# EAGLE design untitled (EAGLE 9.6.2)
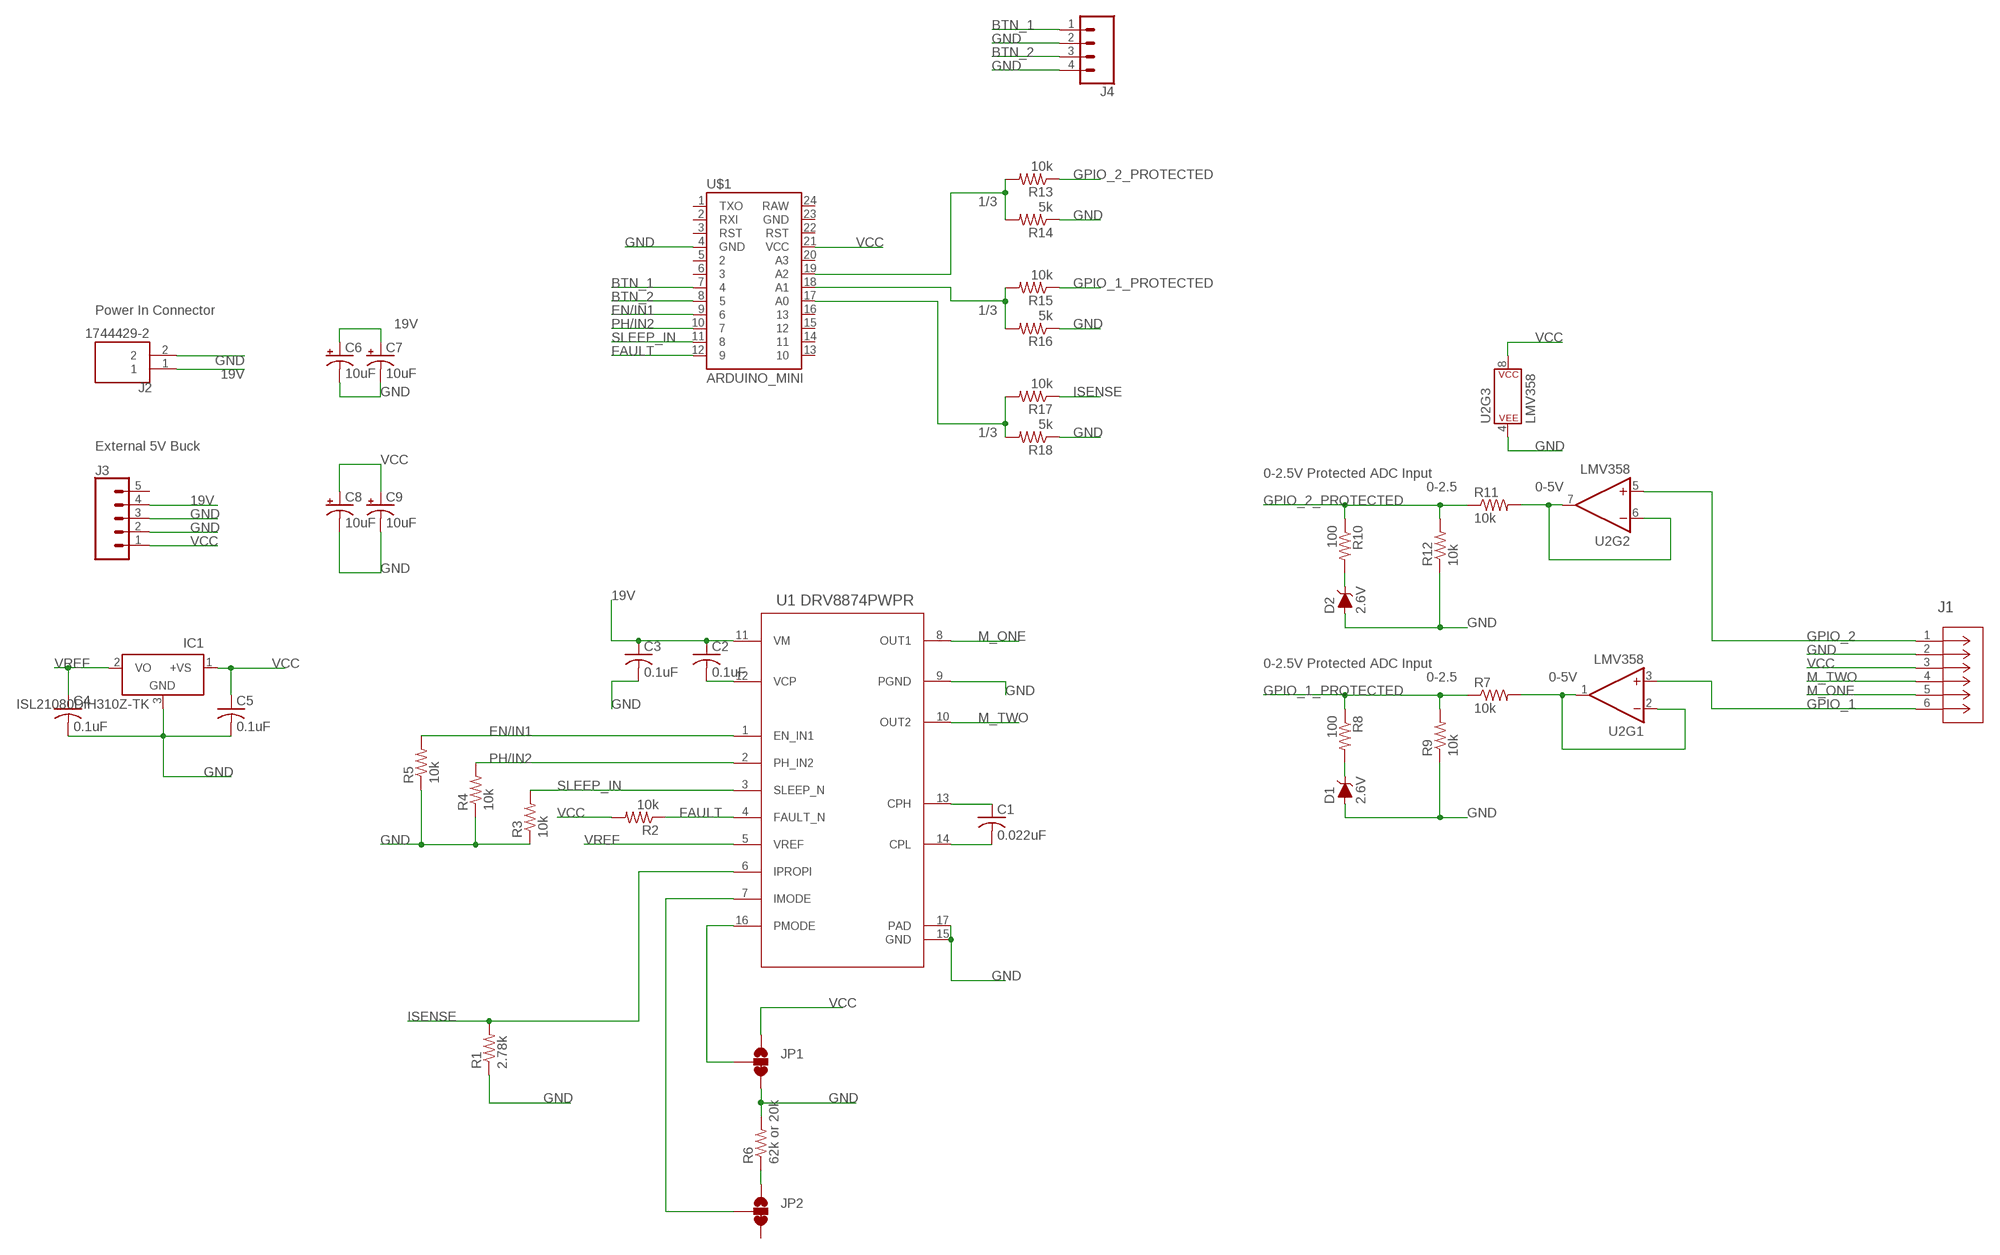
[diagram p0: schematic, sheet 1]

## Parts
C1  0.022uF  C-USC0805K  [C0805K]
C2  0.1uF  C-USC0805K  [C0805K]
C3  0.1uF  C-USC0805K  [C0805K]
C4  0.1uF  C-USC0805K  [C0805K]
C5  0.1uF  C-USC0805K  [C0805K]
C6  10uF  CPOL-USE2.5-6  [E2,5-6]
C7  10uF  CPOL-USE2.5-6  [E2,5-6]
C8  10uF  CPOL-USE2.5-6  [E2,5-6]
C9  10uF  CPOL-USE2.5-6  [E2,5-6]
D1  2.6V  DIODE-ZENER-BZT52C3V6S  [SOD-323]
D2  2.6V  DIODE-ZENER-BZT52C3V6S  [SOD-323]
IC1  ISL21080DIH310Z-TK  LM50  [SOT23]
J1  39301060  [CON_39301060]
J2  1744429-2  [TE_1744429-2]
J3  CONN_05  [1X05]
J4  CONN_041X04_NO_SILK  [1X04_NO_SILK]
JP1  JUMPER-SMT_3_1-NC_TRACE_SILK  [SMT-JUMPER_3_1-NC_TRACE_SILK]
JP2  JUMPER-SMT_3_1-NC_TRACE_SILK  [SMT-JUMPER_3_1-NC_TRACE_SILK]
R1  2.78k  R-US_R0805  [R0805]
R2  10k  R-US_R0805  [R0805]
R3  10k  R-US_R0805  [R0805]
R4  10k  R-US_R0805  [R0805]
R5  10k  R-US_R0805  [R0805]
R6  62k or 20k  R-US_R0805  [R0805]
R7  10k  R-US_R0805  [R0805]
R8  100  R-US_R0805  [R0805]
R9  10k  R-US_R0805  [R0805]
R10  100  R-US_R0805  [R0805]
R11  10k  R-US_R0805  [R0805]
R12  10k  R-US_R0805  [R0805]
R13  10k  R-US_R0805  [R0805]
R14  5k  R-US_R0805  [R0805]
R15  10k  R-US_R0805  [R0805]
R16  5k  R-US_R0805  [R0805]
R17  10k  R-US_R0805  [R0805]
R18  5k  R-US_R0805  [R0805]
U1  DRV8874PWPR  [PWP0016J_N]
U2  LMV358  LMV358SOIC  [SO08]
U$1  ARDUINO_MINI  [ARDUINO_MINI]

## Nets
19V: C2.1 C3.1 C6.+ C7.+ J2.1 J3.4 U1.11(VM)
BTN_1: J4.1 U$1.7
BTN_2: J4.3 U$1.8
EN/IN1: R5.2 U1.1(EN_IN1) U$1.9
FAULT: R2.1 U1.4(FAULT_N) U$1.12
GND: C3.2 C4.2 C5.2 C6.- C7.- C8.- C9.- D1.A D2.A IC1.3(GND) J1.2 J2.2 J3.2 J3.3 J4.2 J4.4 JP1.3 R1.1 R3.1 R4.1 R5.1 R6.2 R9.1 R12.1 R14.1 R16.1 R18.1 U1.9(PGND) U1.15(GND) U1.17(PAD) U2.4(P$V-) U$1.4(GND)
GPIO_1: J1.6 U2.3(+IN)
GPIO_1_PROTECTED: R7.1 R8.1 R9.2 R15.1
GPIO_2: J1.1 U2.5(+IN)
GPIO_2_PROTECTED: R10.1 R11.1 R12.2 R13.1
ISENSE: R1.2 R17.1 U1.6(IPROPI)
M_ONE: J1.5 U1.8(OUT1)
M_TWO: J1.4 U1.10(OUT2)
N$1: C1.2 U1.14(CPL)
N$2: C1.1 U1.13(CPH)
N$3: R17.2 R18.2 U$1.17(A0)
N$4: C2.2 U1.12(VCP)
N$5: JP1.2 U1.16(PMODE)
N$6: R7.2 U2.1(OUT) U2.2(-IN)
N$7: D1.C R8.2
N$8: R11.2 U2.6(-IN) U2.7(OUT)
N$9: D2.C R10.2
N$10: JP2.2 U1.7(IMODE)
N$12: JP2.1 R6.1
N$13: R13.2 R14.2 U$1.19(A2)
N$15: R15.2 R16.2 U$1.18(A1)
PH/IN2: R4.2 U1.2(PH_IN2) U$1.10
SLEEP_IN: R3.2 U1.3(SLEEP_N) U$1.11
VCC: C5.1 C8.+ C9.+ IC1.1(+VS) J1.3 J3.1 JP1.1 R2.2 U2.8(P$V+) U$1.21(VCC)
VREF: C4.1 IC1.2(VO) U1.5(VREF)
Unconnected: J3.5 JP2.3 U$1.1(TXO) U$1.2(RXI) U$1.3(RST) U$1.5 U$1.6 U$1.13 U$1.14 U$1.15 U$1.16 U$1.20(A3) U$1.22(RST) U$1.23(GND) U$1.24(RAW)

## Notes on the sheet
- 1/3
- Power In Connector | 1/3
- 1/3
- External 5V Buck
- 0-2.5V Protected ADC Input
- 0-2.5 | 0-5V
- 0-2.5V Protected ADC Input
- 0-2.5 | 0-5V

## Library data of the parts
C1-C5 = adafruit:C-US: CAPACITOR, American symbol
C6-C9 = adafruit:CPOL-US: POLARIZED CAPACITOR, American symbol
D1 D2 = SparkFun-DiscreteSemi:DIODE-ZENER: Zener Diode A Zener diode allows current to flow from its anode to its cathode like a normal semiconductor diode, but it also permits current to flow in the reverse direction when its "Zener voltage" is reached. - WIkipedia; PROD_ID: DIO-08199; VALUE: 3.6V
IC1 = linear:LM50: SOT-23 Single-Supply Centigrade Temperature Sensor Vout = (10mV/°C x Temp °C) +5mmmV Source: http://cache.national.com/ds/LM/LM50.pdf
J1 = 39301060:39301060; COPYRIGHT: Copyright (C) 2022 Ultra Librarian. All rights reserved.; MANUFACTURER_PART_NUMBER: 39301060; MFR_NAME: Molex Connector Corporation
J2 = 1744429-2:1744429-2: 3.96 EP HDR ASSY 6P W/PEGS, GW,NO PIN 3; MANUFACTURER: TE; PARTREV: R; STANDARD: Manufacturer Recommendations
J3 = SparkFun-Connectors:CONN_05: Multi connection point. Often used as Generic Header-pin footprint for 0.1 inch spaced/style header connections On any of the 0.1 inch spaced packages, you can populate with these: Break Away Headers - Straight <https://www.sparkfun.com/products/116> (PRT-00116) Break Away Male Headers - Right Angle <https://www.sparkfun.com/products/553> (PRT-00553) Female Headers <https://www.sparkfun.com/products/115> (PRT-00115) Break Away Headers - Machine Pin <https://www.sparkfun.com/products/117> (PRT-00117) Break Away Female Headers - Swiss Machine Pin <https://www.sparkfun.com/products/743> (PRT-00743) For SCREWTERMINALS and SPRING TERMINALS visit here: Screw Terimnals on SparkFun.com <https://www.sparkfun.com/search/results?term=Screw+Terminals> (5mm/3.5mm/2.54mm spacing) This device is also useful as a general connection point to wire up your design to another part of your project. Our various solder wires solder well into these plated through hole pads. Hook-Up Wire - Assortment (Stranded, 22 AWG) <https://www.sparkfun.com/products/11375> (PRT-11375) Hook-Up Wire - Assortment (Solid Core, 22 AWG) <https://www.sparkfun.com/products/11367> (PRT-11367) View the entire wire category on our website here <https://www.sparkfun.com/categories/141> Special notes: Molex polarized connector foot print use with SKU : PRT-08231 with associated crimp pins and housings. 1MM SMD Version SKU: PRT-10208
J4 = SparkFun-Connectors:CONN_04: Multi connection point. Often used as Generic Header-pin footprint for 0.1 inch spaced/style header connections On any of the 0.1 inch spaced packages, you can populate with these: Break Away Headers - Straight <https://www.sparkfun.com/products/116> (PRT-00116) Break Away Male Headers - Right Angle <https://www.sparkfun.com/products/553> (PRT-00553) Female Headers <https://www.sparkfun.com/products/115> (PRT-00115) Break Away Headers - Machine Pin <https://www.sparkfun.com/products/117> (PRT-00117) Break Away Female Headers - Swiss Machine Pin <https://www.sparkfun.com/products/743> (PRT-00743) For SCREWTERMINALS and SPRING TERMINALS visit here: Screw Terimnals on SparkFun.com <https://www.sparkfun.com/search/results?term=Screw+Terminals> (5mm/3.5mm/2.54mm spacing) This device is also useful as a general connection point to wire up your design to another part of your project. Our various solder wires solder well into these plated through hole pads. Hook-Up Wire - Assortment (Stranded, 22 AWG) <https://www.sparkfun.com/products/11375> (PRT-11375) Hook-Up Wire - Assortment (Solid Core, 22 AWG) <https://www.sparkfun.com/products/11367> (PRT-11367) View the entire wire category on our website here <https://www.sparkfun.com/categories/141> Special notes: Molex polarized connector foot print use with SKU : PRT-08231 with associated crimp pins and housings. 1MM SMD Version SKU: PRT-10208; PROD_ID: CONN-09696
JP1 JP2 = SparkFun-Jumpers:JUMPER-SMT_3_1-NC_TRACE: Normally closed trace jumper (1 of 2 connections) This jumper has a trace between two pads so it's normally closed (NC). The other connection is normally open (NO). Use a razor knife to open the connection. For best results follow the IPC guidelines for cutting traces: Cutout at least 0.063 mm (0.005 in). Remove all loose material to clean up the cut area. Seal the cut with an approved epoxy. Reapply solder to reclose the connection, or to close the NO connection.
R1-R18 = adafruit:R-US_: RESISTOR, American symbol
U1 = DRV8874:DRV8874PWPR; COPYRIGHT: Copyright (C) 2022 Ultra Librarian. All rights reserved.; MANUFACTURER_PART_NUMBER: DRV8874PWPR; MFR_NAME: Texas Instruments; REFDES: RefDes; TYPE: TYPE
U2 = SparkFun-IC-Amplifiers:LMV358: IC LMV358 DUAL OP AMP Jellybean rail-to-rail output op-amp SparkFun Products SparkFun PicoBoard <https://www.sparkfun.com/products/11888> (WIG-11888) SparkFun Vernier Interface Shield <https://www.sparkfun.com/products/12858> (DEV-12858) SparkFun Blynk Board - ESP8266 <https://www.sparkfun.com/products/13794> (WRL-13794) SparkFun Digital Sandbox <https://www.sparkfun.com/products/12651> (DEV-12651 RoHS); PROD_ID: IC-09657
U$1 = SparkFun-Retired:ARDUINO_MINI: Arduino Pro Mini footprint

## Board
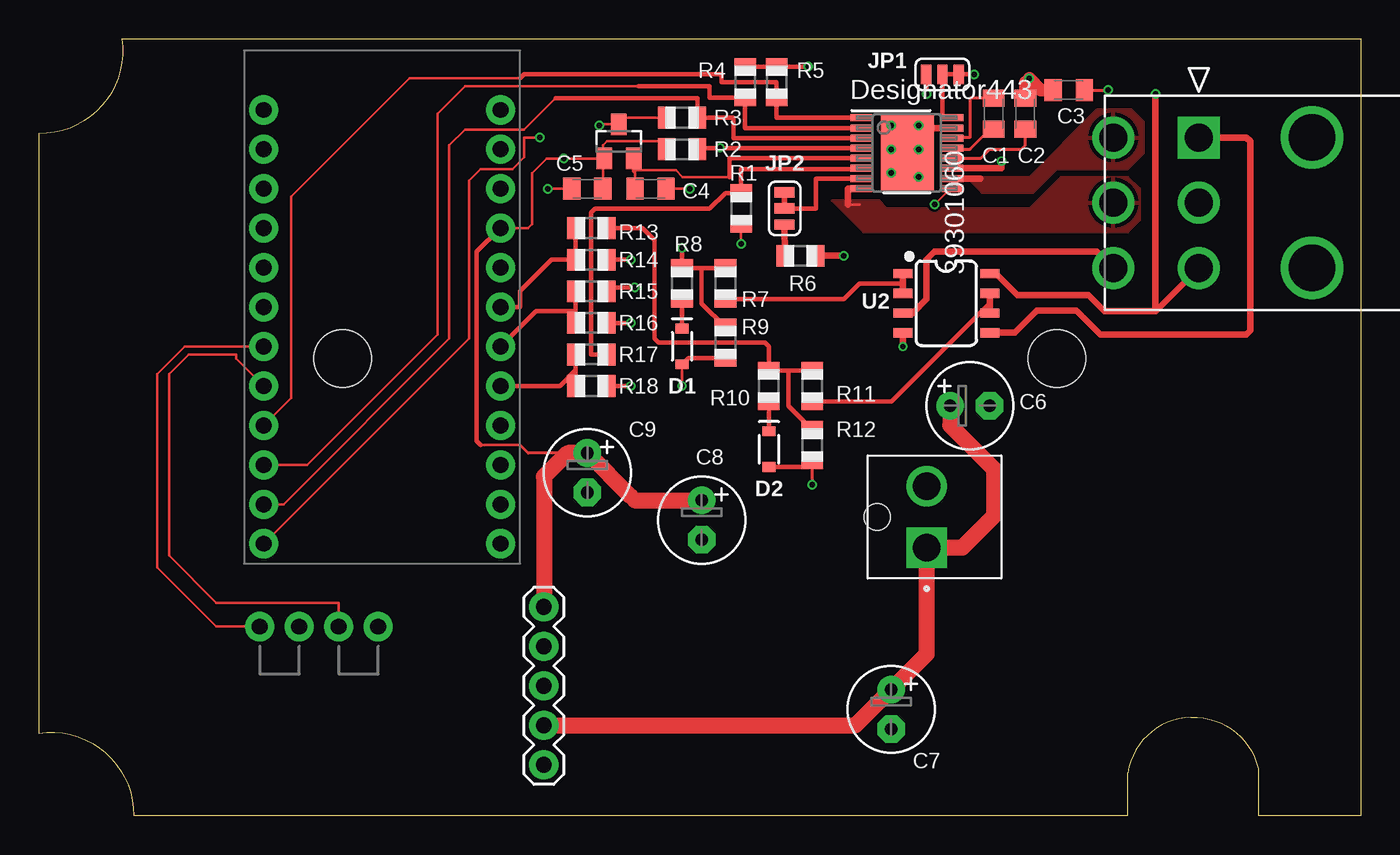
[diagram p1: board, top side]
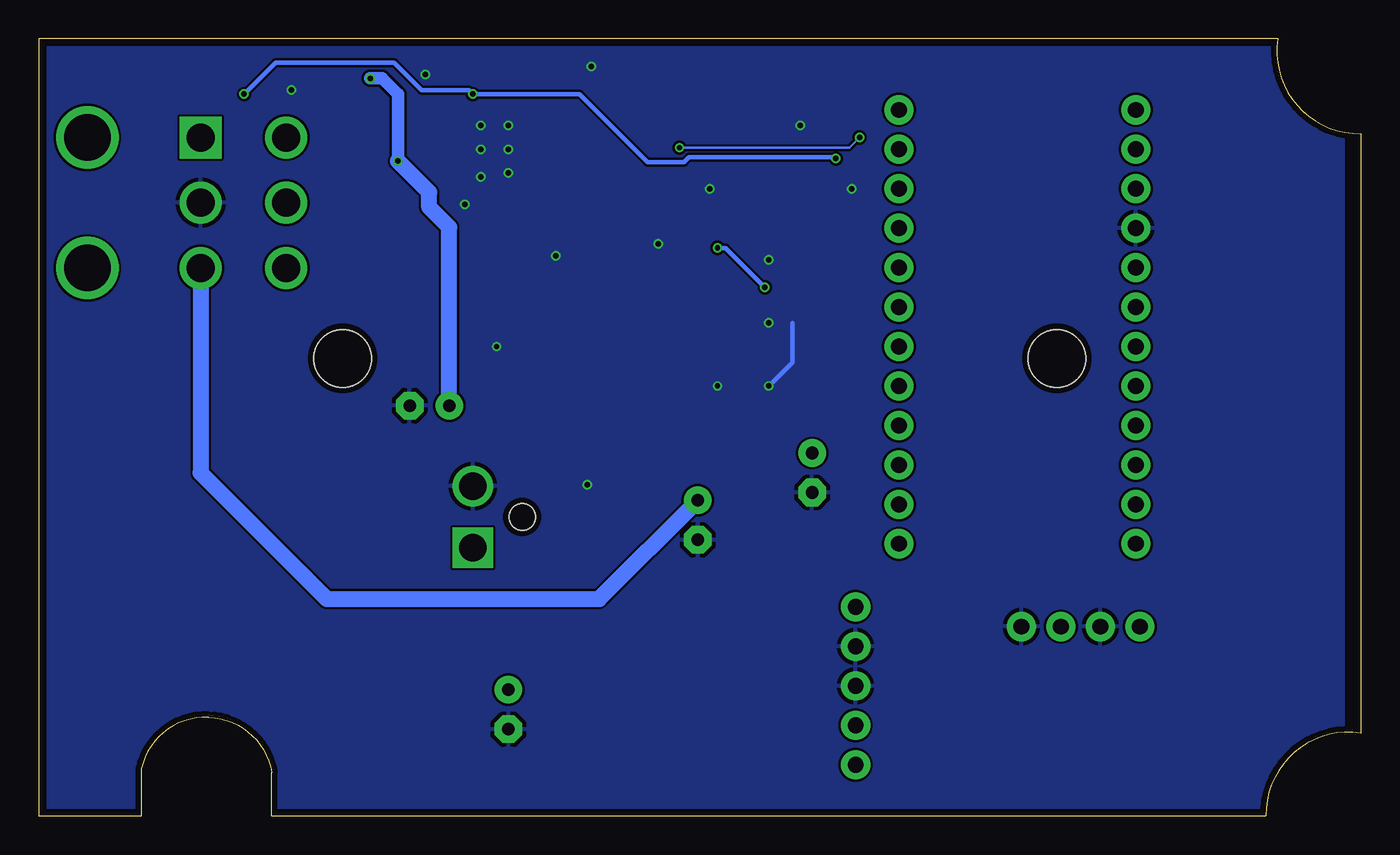
[diagram p2: board, bottom side, seen from below]

Size 85.09 x 50.04 mm. Coordinates in mm from the lower left corner, seen from the top.
Outline: 5.33,50.04 arc-100 0,43.94 0,5.33 arc-100 6.1,0 70.1,0 70.1,2.79 arc-80 74.17,6.35 arc-80 78.49,3.05 78.49,0 85.09,0 85.09,50.04 5.33,50.04
Copper layers (1*16): Top 0.035559375mm / dielectric 1.6mm / Bottom 0.035559375mm
Design rules "oshpark-2layer": minimum track width 6mil, minimum drill 10mil, track to track 6mil, track to pad 6mil, pad to pad 6mil, via to via 6mil, smd to smd 6mil, copper to edge 15mil, drill to drill 6mil, minimum pad ring 5mil, minimum via ring 5mil, stop-mask expansion 2.5mil, vias tented up to drill 0mil, thermal gap 10mil
Holes 3.7 mm at 19.56,29.46 65.53,29.46

### Footprints (pad centres in the part's own frame; a part is rotated, then mirrored left to right if it is on the bottom)
C0805K = smd 1.1 x 1.4: 1 -1,0; 2 1,0
E2,5-6 = drill 0.813 pad 1.778: + -1.27,0 | drill 0.813 pad 1.778 octagon: - 1.27,0
SOD-323 = smd 0.63 x 0.83: A 1.15,0; C -1.15,0
SOT23 = smd 1 x 1.4: 1 -0.95,-1.1; 2 0.95,-1.1; 3 0,1.1
CON_39301060 = drill 1.803 pad 2.311 square: 1 0,0 | drill 1.803 pad 2.311: 2 -4.191,0; 3 -8.407,0; 4 0,5.512; 5 -4.191,5.512; 6 -8.407,5.512 | drill 2.997 pad 2.997: M1 0,-7.29; M2 -8.407,-7.29
TE_1744429-2 = drill 1.75 pad 2.1 square: 1 0,0 | drill 1.75 pad 2.1: 2 3.96,0 | hole 1.68: 1.98,3.18; 1.98,3.18
1X05 = drill 1.016 pad 1.88: 1 0,0; 2 2.54,0; 3 5.08,0; 4 7.62,0; 5 10.16,0
1X04_NO_SILK = drill 1.016 pad 1.88: 1 0,0; 2 2.54,0; 3 5.08,0; 4 7.62,0
SMT-JUMPER_3_1-NC_TRACE_SILK = smd 0.66 x 1.27: 1 -1.041,0; 2 0,0; 3 1.041,0
R0805 = smd 1.1 x 1.4: 1 -1,0; 2 1,0
PWP0016J_N = smd 1.4 x 0.45: 1 -2.95,2.275; 2 -2.95,1.625; 3 -2.95,0.975; 4 -2.95,0.325; 5 -2.95,-0.325; 6 -2.95,-0.975; 7 -2.95,-1.625; 8 -2.95,-2.275; 9 2.95,-2.275; 10 2.95,-1.625; 11 2.95,-0.975; 12 2.95,-0.325; 13 2.95,0.325; 14 2.95,0.975; 15 2.95,1.625; 16 2.95,2.275 | smd 3.4 x 5: 17 0.025,0 | smd 0.5 x 0.5: 18 0,0; 19 0,-0.95; 20 0,0.95; 21 0,1.9; 22 0,-1.9; 23 1.35,-1.9; 24 1.35,1.9; 25 1.35,0.95; 26 1.35,-0.95; 27 1.35,0; 28 -1.35,0; 29 -1.35,-0.95; 30 -1.35,0.95; 31 -1.35,1.9; 32 -1.35,-1.9
SO08 = smd 0.6 x 1.2: 1 -1.905,-2.8; 2 -0.635,-2.8; 3 0.635,-2.8; 4 1.905,-2.8; 5 1.905,2.8; 6 0.635,2.8; 7 -0.635,2.8; 8 -1.905,2.8
ARDUINO_MINI = drill 1.016 pad 1.88: 1 -7.62,12.7; 2 -7.62,10.16; 3 -7.62,7.62; 4 -7.62,5.08; 5 -7.62,2.54; 6 -7.62,0; 7 -7.62,-2.54; 8 -7.62,-5.08; 9 -7.62,-7.62; 10 -7.62,-10.16; 11 -7.62,-12.7; 12 -7.62,-15.24; 13 7.62,-15.24; 14 7.62,-12.7; 15 7.62,-10.16; 16 7.62,-7.62; 17 7.62,-5.08; 18 7.62,-2.54; 19 7.62,0; 20 7.62,2.54; 21 7.62,5.08; 22 7.62,7.62; 23 7.62,10.16; 24 7.62,12.7

### Placement (x,y rotation side)
C1  61.47,45.21 90 top
C2  63.5,45.21 270 top
C3  66.29,46.74 0 top
C4  39.37,40.39 0 top
C5  35.31,40.39 180 top
C6  59.94,26.42 0 top
C7  54.86,6.86 270 top
C8  42.67,19.05 270 top
C9  35.31,22.1 270 top
D1  41.4,30.23 270 top
D2  46.99,23.62 270 top
IC1  37.34,43.43 0 top
J1  74.68,43.69 90 top
J2  57.15,17.27 90 top
J3  32.51,13.46 270 top
J4  14.22,12.19 0 top
JP1  58.17,47.75 0 top
JP2  48.01,39.12 90 top
R1  45.21,39.12 90 top
R2  41.4,42.93 180 top
R3  41.4,44.96 0 top
R4  45.47,47.24 270 top
R5  47.5,47.24 270 top
R6  49.02,36.07 0 top
R7  44.2,34.29 270 top
R8  41.4,34.29 270 top
R9  44.2,30.48 90 top
R10  46.99,27.69 270 top
R11  49.78,27.69 270 top
R12  49.78,23.88 90 top
R13  35.56,37.85 180 top
R14  35.56,35.81 180 top
R15  35.56,33.78 180 top
R16  35.56,31.75 180 top
R17  35.56,29.72 180 top
R18  35.56,27.69 180 top
U1  55.88,42.67 0 top
U2  58.42,33.02 270 top
U$1  22.1,32.77 0 top

### Tracks (layer width: path | path; a pad name or v marks a point on that pad's centre or on a via)
19V  (via drill 0.35)
  Top 0.406: U1.11 61.98,41.7 v61.98,42.16
  Top 0.813: C2.1 63.5,47.24 v63.75,47.5 64.52,46.74 C3.1
  Top 1.016: J3.4 52.58,5.84 C7.+ 57.15,10.41 J2.1 59.44,17.27 61.47,19.3 61.47,22.35 58.67,25.15 C6.+
  Bottom 0.813: v61.98,42.16 61.98,46.48 62.99,47.5 v63.75,47.5
  Bottom 1.016: C6.+ 58.67,37.9 59.97,39.19 59.97,40.16 v61.98,42.16
BTN_1
  Top 0.152: J4.1 11.43,12.19 7.62,16 7.62,28.45 9.4,30.23 U$1.7
BTN_2
  Top 0.152: U$1.8 12.7,29.46 12.7,29.72 9.65,29.72 8.38,28.45 8.38,16.76 11.43,13.72 19.3,13.72 J4.3
EN/IN1
  Top 0.152: U$1.9 16.26,26.92 16.26,39.88 23.88,47.5 30.99,47.5
  Top 0.305: U1.1 47.51,44.95 47.5,44.96 R5.2 47.5,47.24 43.94,47.24 43.94,47.75 31.24,47.75 30.99,47.5
FAULT  (via drill 0.35)
  Top 0.152: U$1.12 27.69,30.73 27.69,40.89 28.45,41.66 30.48,41.66 31.24,42.42 31.24,43.69 v32.26,43.69 | R2.1 42.51,43.03 v43.85,43.03
  Top 0.305: R2.1 42.4,43 U1.4
  Bottom 0.152: v43.85,43.03 32.92,43.03 v32.26,43.69
GND  (via drill 0.35)
  Top 0.152: U1.9 58.69,40.4 v57.66,39.37 | C5.2 v32.77,40.39 | D1.A v41.4,27.69 | R1.1 v45.21,36.83 | v36.07,44.45 36.15,44.53 IC1.3 37.76,44.96 R3.1 | C4.2 v41.91,40.39
  Top 0.2: 55.91,43.69 55.91,44.3 | C3.2 v68.83,46.74
  Top 0.203: R12.1 v49.78,21.34 | 55.91,43.69 U1.17 56.16,42.93 v56.64,42.93
  Top 0.305: JP1.3 v60.2,47.75 | R4.1 R5.1 49.51,48.24 v49.53,48.26 | D2.A 49.38,22.47 R12.1 | D1.A 41.81,29.48 R9.1 | R18.1 v38.1,27.69 | R16.1 v38.1,31.75 | R14.1 v38.1,35.81
  Top 0.406: U2.4 v55.63,30.23 | R6.2 v51.82,36.07 | 55.91,44.3 U1.15
  Bottom 0.305: v38.1,27.69 36.58,29.21 36.58,31.75
  other vias: 54.86,44.45 56.64,44.45 54.86,42.93 54.86,41.4 56.64,41.15
  pour Bottom: 1.02,49.53 84.58,49.53 84.58,0.51 1.02,0.51
GPIO_1
  Top 0.406: U2.3 56.26,32.38 57.15,33.27 57.15,35.81 57.66,36.32 68.12,36.32 J1.6
GPIO_1_PROTECTED  (via drill 0.35)
  Top 0.305: 42.67,35.29 R8.1 v41.4,36.58 | 42.67,35.29 R7.1 | R9.2 42.67,33 42.67,35.29 | R15.1 36.81,34.04 v38.35,34.04
  Bottom 0.305: v38.35,34.04 40.89,36.58 v41.4,36.58
GPIO_2
  Top 0.406: J1.1 77.72,43.69 77.98,43.43 77.98,31.24 77.72,30.99 68.35,30.99 66.8,32.53 64.26,32.53 62.84,31.11 U2.5
GPIO_2_PROTECTED
  Top 0.305: R11.1 48.26,28.69 | 48.26,28.69 R10.1 46.99,30.23 46.74,30.48 39.88,30.48 39.62,30.73 39.62,37.08 38.86,37.85 R13.1 | R12.2 48.26,26.4 48.26,28.69
ISENSE
  Top 0.305: U1.6 52.93,41.66 45.21,41.66 R1.2 44.2,40.12 43.18,39.1 35.8,39.1 35.56,38.86 35.56,29.72 R17.1
M_ONE
  Top 0.152: U1.8 52.92,40.39 | 52.07,39.37 52.83,39.37
  Top 0.406: 52.92,40.39 52.07,40.39 52.07,39.37
  pour Top: 70.1,41.15 65.79,41.15 63.75,39.12 54.61,39.12 54.1,39.62 51.05,39.62 53.09,37.59 70.1,37.59 70.87,38.35 70.87,40.39
M_TWO
  Top 0.152: 60.6,41.05 60.71,41.15
  Top 0.406: U1.10 60.6,41.05
  pour Top: 70.36,45.47 68.07,45.47 63.75,41.15 59.94,41.15 59.94,40.89 60.71,40.13 64.01,40.13 65.53,41.66 70.1,41.66 71.12,42.67 71.12,44.7
N$1
  Top 0.152: 58.83,43.69 U1.14
  Top 0.2: C1.2 59.94,46.21 59.94,43.69 58.83,43.69
N$2
  Top 0.2: U1.13 59.37,43 59.44,42.93 59.94,42.93 61.23,44.21 C1.1
N$3
  Top 0.305: R17.2 34.56,28.7 | 34.56,28.7 R18.2 | U$1.17 33.54,27.69 34.56,28.7
N$4
  Top 0.2: U1.12 60.63,42.35 61.21,42.93 63.25,42.93 63.5,43.18 C2.2
N$5
  Top 0.305: U1.16 58.17,44.95 JP1.2
  Top 0.406: U1.16 58.84,44.96
N$6
  Top 0.305: R7.2 51.83,33.29 52.83,34.29 55.62,34.29
  Top 0.406: U2.2 55.62,34.29 U2.1
N$7
  Top 0.305: R8.2 D1.C
N$8
  Top 0.305: R11.2 54.89,26.69 61.22,33.02
  Top 0.406: U2.6 61.22,33.02 U2.7
N$9
  Top 0.305: R10.2 D2.C
N$10
  Top 0.305: U1.7 50.04,41.05 50.04,39.12 48.16,39.12 48.16,39.27
  Top 0.406: 48.16,39.27 JP2.2
N$12
  Top 0.406: JP2.1 R6.1
N$13
  Top 0.305: R13.2 R14.2 33.02,35.81 30.99,33.78 30.99,32.77 U$1.19
N$15
  Top 0.305: R16.2 34.56,32.51 | 34.56,32.51 R15.2 | U$1.18 32,32.51 34.56,32.51
PH/IN2
  Top 0.152: U$1.10 17.27,22.61 25.65,30.99 25.65,45.21 27.43,46.99 38.61,46.99
  Top 0.305: U1.2 45.47,44.3 R4.2 43.18,46.24 43.18,46.99 38.61,46.99
SLEEP_IN
  Top 0.152: U$1.11 15.75,20.07 26.42,30.73 26.42,43.18 27.43,44.2 31.24,44.2 33.27,46.23
  Top 0.305: U1.3 44.7,43.65 44.7,44.96 R3.2 42.4,46.23 33.27,46.23
VCC  (via drill 0.35)
  Top 0.152: C5.1 36.31,42.25 IC1.1 | R2.2 39.89,43.43 36.58,43.43 36.32,43.18 36.32,42.4 IC1.1 | IC1.1 v33.78,42.33 32.68,42.33 31.75,41.4 31.75,38.1 31.5,37.85 U$1.21 | 30.99,23.88 28.45,23.88
  Top 0.203: C9.+ 31.5,23.37 30.99,23.88 | 38.1,20.57 38.35,20.32
  Top 0.305: JP1.1 57.12,46.48 v57.15,46.48 | U$1.21 28.19,36.32 28.19,24.13 28.45,23.88
  Top 0.406: U2.8 61.59,34.92 62.99,33.53 67.56,33.53 68.58,32.51 71.91,32.51 | J1.3 71.91,32.51 | 71.91,32.51 71.88,32.54 v71.88,46.48
  Top 1.016: 38.1,20.57 C9.+ 34.04,23.37 32.51,21.84 J3.1 | 38.35,20.32 C8.+
  Bottom 0.305: v71.88,46.48 69.85,48.51 62.23,48.51 60.45,46.74 57.4,46.74 v57.15,46.48 50.29,46.48 45.9,42.09 43.56,42.09 43.24,42.42 33.78,42.42 v33.78,42.33
  Bottom 1.016: J1.3 74.68,22.1 66.55,13.97 49.02,13.97 C8.+
VREF
  Top 0.152: IC1.2 38.37,42.25 38.37,41.57 41.02,41.57 41.44,41.15 44.45,41.15 | 38.37,42.16 38.37,41.4 C4.1
  Top 0.203: 38.37,41.4 38.29,41.48 IC1.2
  Top 0.305: U1.5 44.45,42.35 44.45,41.15

### Text on the board
Document: VCC | GND | GND | 19V
tDocu: BTN1 | BTN2